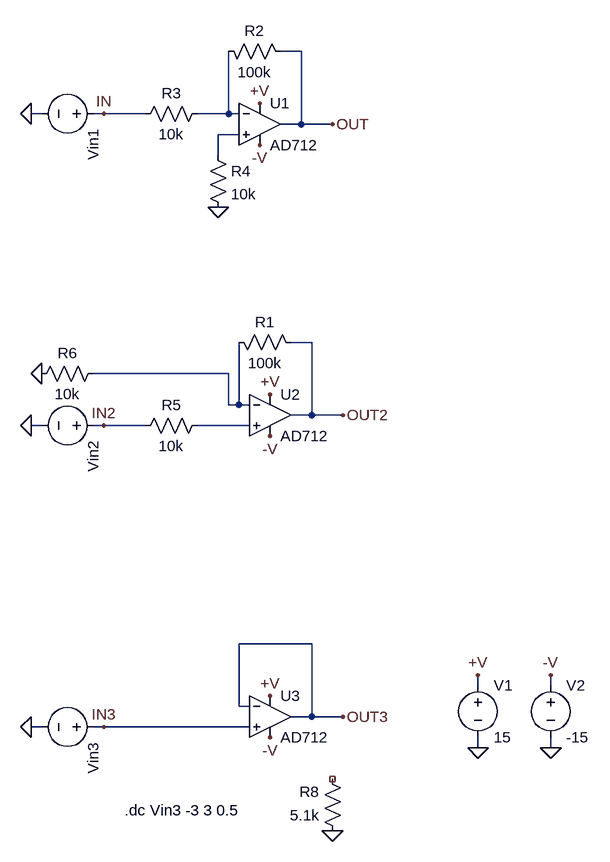
[diagram p0: schematic InvertingProportionalAmplifier.asc]
InvertingProportionalAmplifier.asc, the LTspice schematic file:
Version 4.1
SHEET 1 880 1236
WIRE 336 16 304 16
WIRE -64 112 -80 112
WIRE 32 112 16 112
WIRE 96 112 32 112
WIRE 224 112 224 16
WIRE 224 112 176 112
WIRE 240 112 224 112
WIRE 336 128 336 16
WIRE 336 128 304 128
WIRE 384 128 336 128
WIRE 240 144 208 144
WIRE 208 176 208 144
WIRE 352 464 320 464
WIRE 224 512 16 512
WIRE 224 560 224 512
WIRE 240 560 240 464
WIRE 240 560 224 560
WIRE 256 560 240 560
WIRE 352 576 352 464
WIRE 352 576 320 576
WIRE 400 576 352 576
WIRE -64 592 -80 592
WIRE 32 592 16 592
WIRE 96 592 32 592
WIRE 256 592 176 592
WIRE 352 928 240 928
WIRE 608 992 608 976
WIRE 720 992 720 976
WIRE 240 1024 240 928
WIRE 256 1024 240 1024
WIRE 352 1040 352 928
WIRE 352 1040 320 1040
WIRE 400 1040 352 1040
WIRE -64 1056 -80 1056
WIRE 32 1056 16 1056
WIRE 256 1056 32 1056
WIRE 608 1088 608 1072
WIRE 720 1088 720 1072
FLAG -80 112 0
FLAG 384 128 OUT
FLAG 32 112 IN
FLAG 272 96 +V
FLAG 272 160 -V
FLAG 208 256 0
FLAG 608 976 +V
FLAG 608 1088 0
FLAG 720 976 -V
FLAG 720 1088 0
FLAG -80 592 0
FLAG 400 576 OUT2
FLAG 32 592 IN2
FLAG 288 544 +V
FLAG 288 608 -V
FLAG -64 512 0
FLAG -80 1056 0
FLAG 400 1040 OUT3
FLAG 32 1056 IN3
FLAG 288 1008 +V
FLAG 288 1072 -V
FLAG 384 1216 0
SYMBOL voltage 32 112 R90
WINDOW 123 24 146 Left 2
WINDOW 39 24 125 Left 2
SYMATTR InstName Vin1
SYMATTR Value ""
SYMBOL AD712 272 64 R0
SYMATTR InstName U1
SYMBOL res 208 0 M90
WINDOW 0 0 56 VBottom 2
WINDOW 3 32 56 VTop 2
SYMATTR InstName R2
SYMATTR Value 100k
SYMBOL res 192 96 R90
WINDOW 0 0 56 VBottom 2
WINDOW 3 32 56 VTop 2
SYMATTR InstName R3
SYMATTR Value 10k
SYMBOL res 192 160 R0
SYMATTR InstName R4
SYMATTR Value 10k
SYMBOL voltage 608 976 R0
WINDOW 123 0 0 Left 2
WINDOW 39 0 0 Left 2
SYMATTR InstName V1
SYMATTR Value 15
SYMBOL voltage 720 976 R0
WINDOW 123 24 146 Left 2
WINDOW 39 24 125 Left 2
SYMATTR InstName V2
SYMATTR Value -15
SYMBOL voltage 32 592 R90
WINDOW 123 24 146 Left 2
WINDOW 39 24 125 Left 2
SYMATTR InstName Vin2
SYMATTR Value ""
SYMBOL AD712 288 512 R0
SYMATTR InstName U2
SYMBOL res 224 448 M90
WINDOW 0 0 56 VBottom 2
WINDOW 3 32 56 VTop 2
SYMATTR InstName R1
SYMATTR Value 100k
SYMBOL res 192 576 R90
WINDOW 0 0 56 VBottom 2
WINDOW 3 32 56 VTop 2
SYMATTR InstName R5
SYMATTR Value 10k
SYMBOL res 32 496 R90
WINDOW 0 0 56 VBottom 2
WINDOW 3 32 56 VTop 2
SYMATTR InstName R6
SYMATTR Value 10k
SYMBOL voltage 32 1056 R90
WINDOW 123 24 146 Left 2
WINDOW 39 24 125 Left 2
SYMATTR InstName Vin3
SYMATTR Value ""
SYMBOL AD712 288 976 R0
SYMATTR InstName U3
SYMBOL res 400 1232 R180
WINDOW 0 36 76 Left 2
WINDOW 3 36 40 Left 2
SYMATTR InstName R8
SYMATTR Value 5.1k
TEXT 64 1184 Left 2 !.dc Vin3 -3 3 0.5

The netlist it stands for:
* InvertingProportionalAmplifier.asc
Vin1 IN 0
* U1: AD712 (symbol AD712 not available, pins judged from their places): In+=N002 In-=N001 V+=+V V-=-V OUT=OUT
R2 N001 OUT 100k
R3 N001 IN 10k
R4 N002 0 10k
V1 +V 0 15
V2 -V 0 -15
Vin2 IN2 0
* U2: AD712 (symbol AD712 not available, pins judged from their places): In+=N004 In-=N003 V+=+V V-=-V OUT=OUT2
R1 N003 OUT2 100k
R5 N004 IN2 10k
R6 N003 0 10k
Vin3 IN3 0
* U3: AD712 (symbol AD712 not available, pins judged from their places): In+=IN3 In-=OUT3 V+=+V V-=-V OUT=OUT3
R8 0 NC_01 5.1k
.dc Vin3 -3 3 0.5
.backanno
.end